# Altium schematic sheet EtherWiz.SchDoc
size A3; SheetNumber: 1; SheetTotal: 3
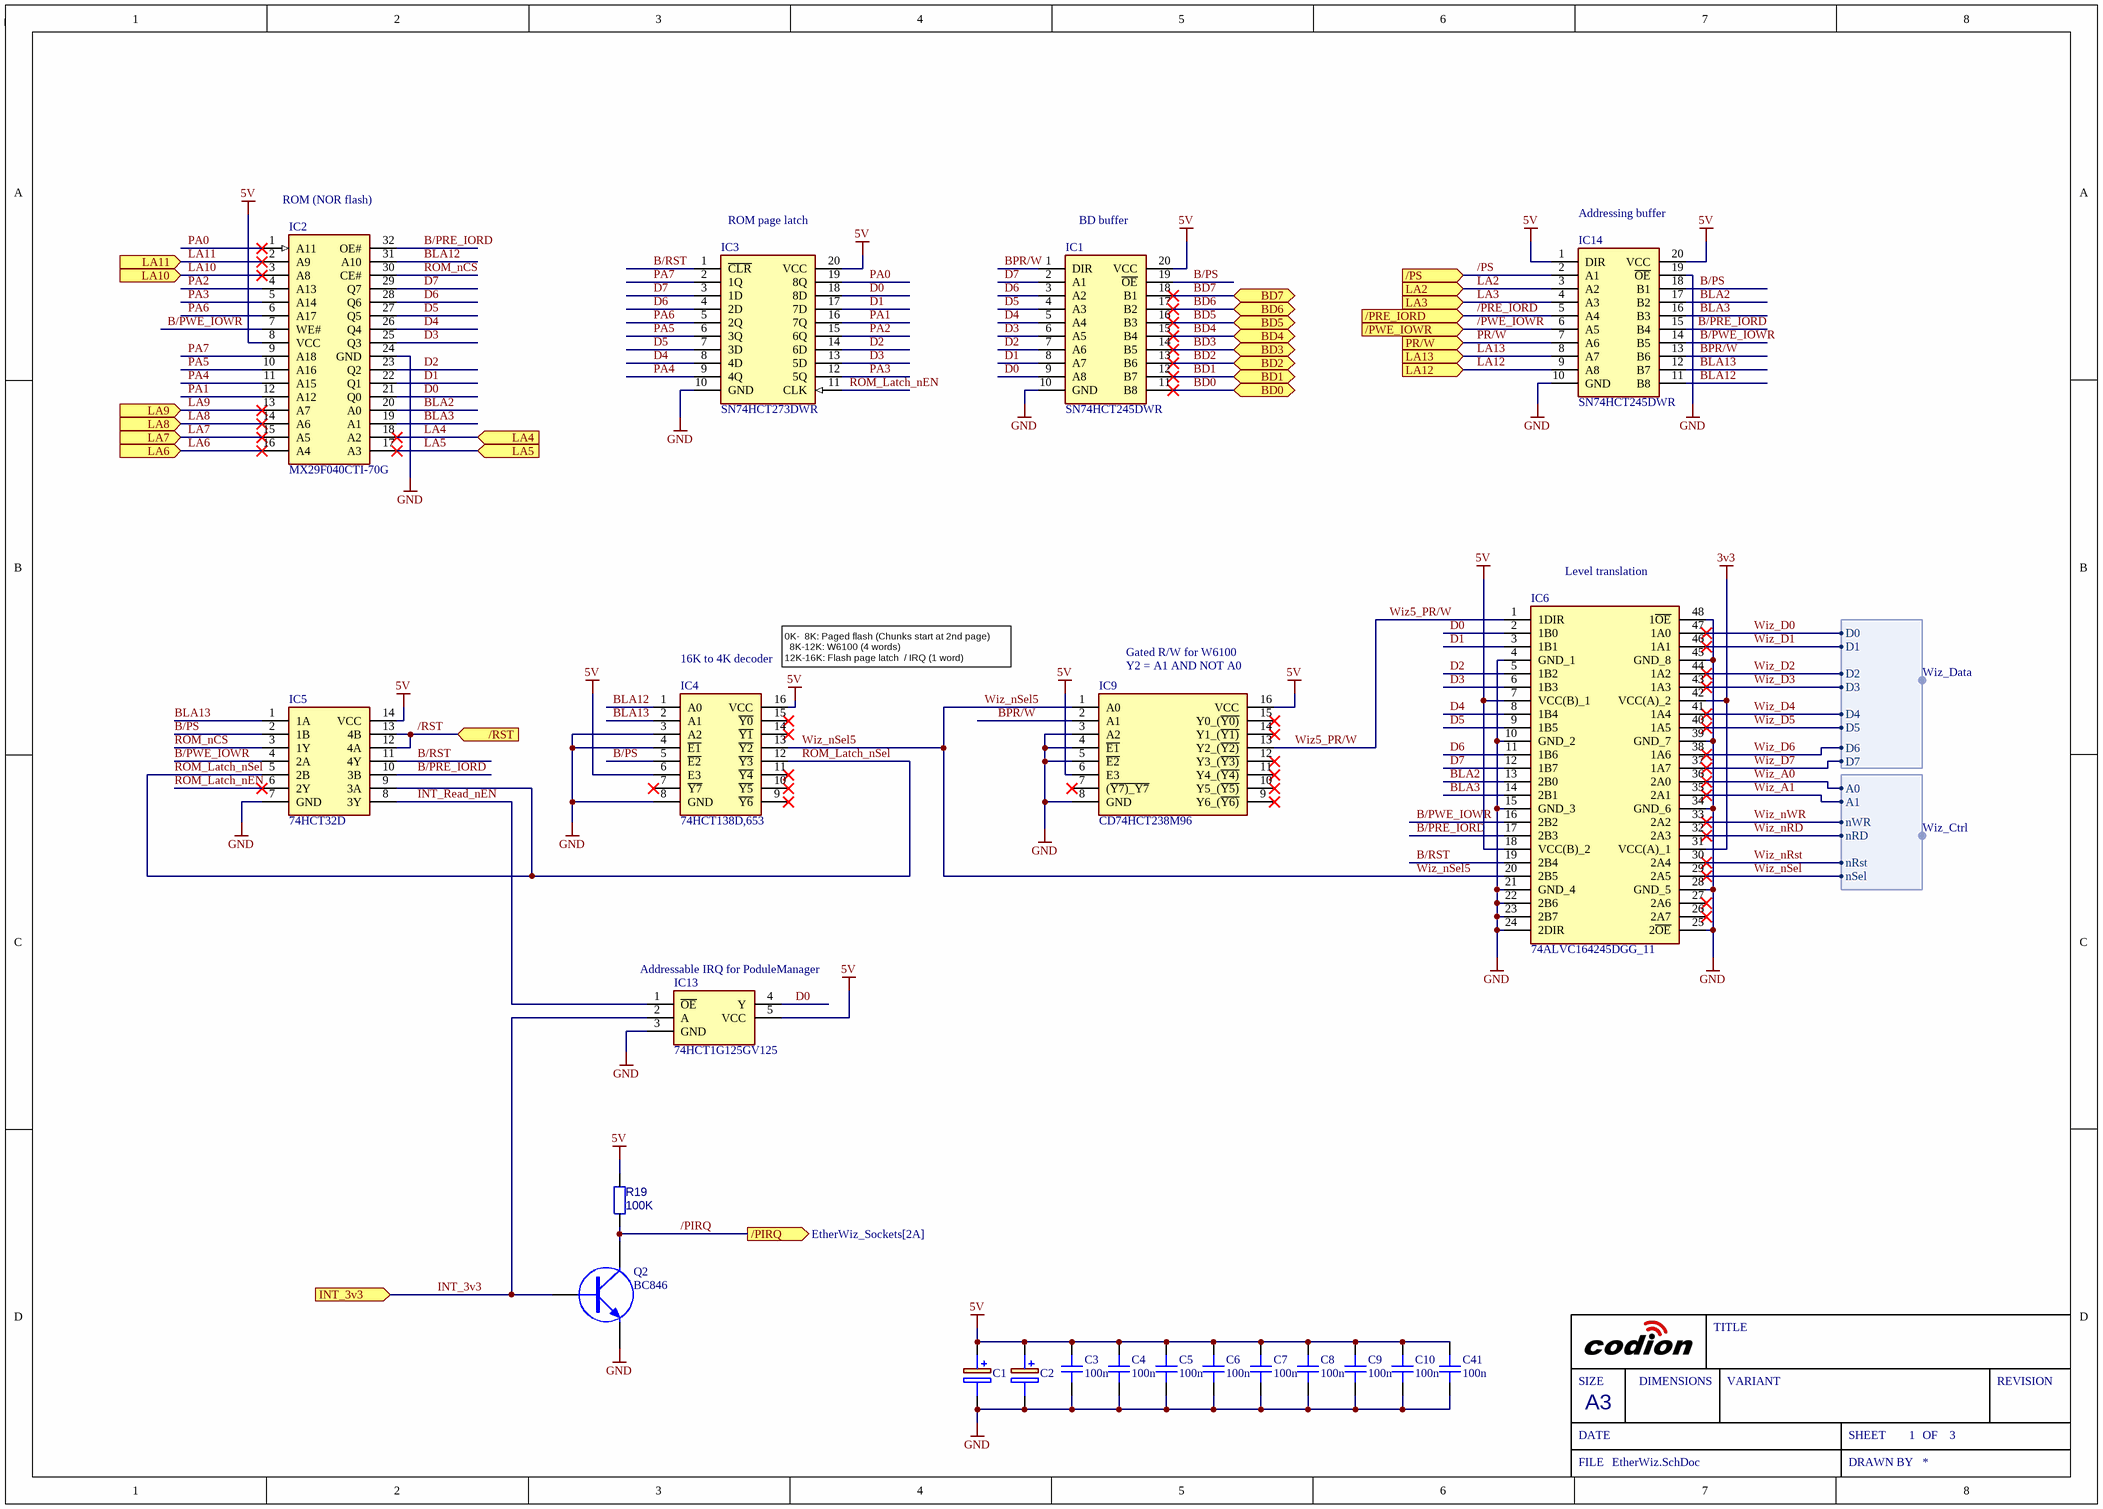
[diagram p0: EtherWiz.SchDoc]

## Parts
C1  EEE-HA1C470AP  [EEE1AA101SP]  (value not drawn)
C2  EEE-HA1C470AP  [EEE1AA101SP]  (value not drawn)
C3  100n  [CAPC1608L]
C4  100n  [CAPC1608L]
C5  100n  [CAPC1608L]
C6  100n  [CAPC1608L]
C7  100n  [CAPC1608L]
C8  100n  [CAPC1608L]
C9  100n  [CAPC1608L]
C10  100n  [CAPC1608L]
C41  100n  [CAPC1608L]
IC1  SN74HCT245DWR  [SOIC127P1030X265-20N]
IC2  MX29F040CTI-70G  [SOP50P2000X120-32N]
IC3  SN74HCT273DWR  [SOIC127P1030X265-20N]
IC4  74HCT138D,653  [SOIC127P600X175-16N]
IC5  74HCT32D  [SOIC127P600X175-14N]
IC6  74ALVC164245DGG_11  [SOP50P810X120-48N]
IC9  CD74HCT238M96  [SOIC127P600X175-16N]
IC13  74HCT1G125GV125  [SOT95P275X110-5N]
IC14  SN74HCT245DWR  [SOIC127P1030X265-20N]
Q2  BC846  [SOT-23]
R19  100K  [RESC1608X50N]

## Ports
/PIRQ (out, see EtherWiz_Sockets[2A]), /PRE_IORD (in, see EtherWiz_Sockets[2A]), /PS (in, see EtherWiz_Sockets[2B]), /PWE_IOWR (in, see EtherWiz_Sockets[2A]), /RST (in, see EtherWiz_Sockets[2A]), BD0 (bidir, see EtherWiz_Sockets[1B]), BD1 (bidir, see EtherWiz_Sockets[1B]), BD2 (bidir, see EtherWiz_Sockets[1B]), BD3 (bidir, see EtherWiz_Sockets[1B]), BD4 (bidir, see EtherWiz_Sockets[1B]), BD5 (bidir, see EtherWiz_Sockets[1B]), BD6 (bidir, see EtherWiz_Sockets[1B]), BD7 (bidir, see EtherWiz_Sockets[1B]), INT_3v3 (in, see EtherWiz_Controller[5A]), LA2 (in, see EtherWiz_Sockets[1A]), LA3 (in, see EtherWiz_Sockets[1A]), LA4 (in, see EtherWiz_Sockets[1A]), LA5 (in, see EtherWiz_Sockets[1A]), LA6 (in, see EtherWiz_Sockets[1A]), LA7 (in, see EtherWiz_Sockets[1A]), LA8 (in, see EtherWiz_Sockets[1A]), LA9 (in, see EtherWiz_Sockets[1A]), LA10 (in, see EtherWiz_Sockets[1A]), LA11 (in, see EtherWiz_Sockets[1A]), LA12 (in, see EtherWiz_Sockets[1A]), LA13 (in, see EtherWiz_Sockets[1A]), PR/W (in, see EtherWiz_Sockets[2A])

## Harnesses
Wiz_Data: D3, D7, D6, D0, D1, D5, D4, D2
Wiz_Ctrl: A0, A1, nWR, nRD, nRst, nSel

## Nets
3v3: IC6.31(VCC(A)_1) IC6.42(VCC(A)_2)
5V: C1.1(+) C2.1(+) C3.2 C4.2 C5.2 C6.2 C7.2 C8.2 C9.2 C10.2 C41.2 IC1.20(VCC) IC2.8(VCC) IC3.20(VCC) IC4.6(E3) IC4.16(VCC) IC5.14(VCC) IC6.7(VCC(B)_1) IC6.18(VCC(B)_2) IC9.6(E3) IC9.16(VCC) IC13.5(VCC) IC14.1(DIR) IC14.20(VCC) R19.2
GND: C1.2(-) C2.2(-) C3.1 C4.1 C5.1 C6.1 C7.1 C8.1 C9.1 C10.1 C41.1 IC1.10(GND) IC2.24(GND) IC3.10(GND) IC4.3(A2) IC4.4(~{E1}) IC4.8(GND) IC5.7(GND) IC6.4(GND_1) IC6.10(GND_2) IC6.15(GND_3) IC6.21(GND_4) IC6.22(2B6) IC6.23(2B7) IC6.24(2DIR) IC6.25(2~{OE}) IC6.28(GND_5) IC6.34(GND_6) IC6.39(GND_7) IC6.45(GND_8) IC6.48(1~{OE}) IC9.3(A2) IC9.4(~{E1}) IC9.5(~{E2}) IC9.8(GND) IC13.3(GND) IC14.10(GND) IC14.19(~{OE}) Q2.2(E)
/PIRQ: Q2.3(C) R19.1 ; port /PIRQ
/PRE_IORD: IC14.5(A4) ; port /PRE_IORD
/PS: IC14.2(A1) ; port /PS
/PWE_IOWR: IC14.6(A5) ; port /PWE_IOWR
/RST: IC5.12(4A) IC5.13(4B) ; port /RST
B/PRE_IORD: IC2.32(OE#) IC5.10(3B) IC6.17(2B3) IC14.15(B4)
B/PS: IC1.19(~{OE}) IC4.5(~{E2}) IC5.2(1B) IC14.18(B1)
B/PWE_IOWR: IC2.7(WE#) IC5.4(2A) IC6.16(2B2) IC14.14(B5)
B/RST: IC3.1(~{CLR}) IC5.11(4Y) IC6.19(2B4)
BD0: IC1.11(B8) ; port BD0
BD1: IC1.12(B7) ; port BD1
BD2: IC1.13(B6) ; port BD2
BD3: IC1.14(B5) ; port BD3
BD4: IC1.15(B4) ; port BD4
BD5: IC1.16(B3) ; port BD5
BD6: IC1.17(B2) ; port BD6
BD7: IC1.18(B1) ; port BD7
BLA2: IC2.20(A0) IC6.13(2B0) IC14.17(B2)
BLA3: IC2.19(A1) IC6.14(2B1) IC14.16(B3)
BLA12: IC2.31(A10) IC4.1(A0) IC14.11(B8)
BLA13: IC4.2(A1) IC5.1(1A) IC14.12(B7)
BPR/W: IC1.1(DIR) IC9.2(A1) IC14.13(B6)
D0: IC1.9(A8) IC2.21(Q0) IC3.18(8D) IC6.2(1B0) IC13.4(Y)
D1: IC1.8(A7) IC2.22(Q1) IC3.17(7D) IC6.3(1B1)
D2: IC1.7(A6) IC2.23(Q2) IC3.14(6D) IC6.5(1B2)
D3: IC1.6(A5) IC2.25(Q3) IC3.13(5D) IC6.6(1B3)
D4: IC1.5(A4) IC2.26(Q4) IC3.8(4D) IC6.8(1B4)
D5: IC1.4(A3) IC2.27(Q5) IC3.7(3D) IC6.9(1B5)
D6: IC1.3(A2) IC2.28(Q6) IC3.4(2D) IC6.11(1B6)
D7: IC1.2(A1) IC2.29(Q7) IC3.3(1D) IC6.12(1B7)
INT_3v3: IC13.2(A) Q2.1(B) ; port INT_3v3
INT_Read_nEN: IC5.8(3Y) IC13.1(~{OE})
LA2: IC14.3(A2) ; port LA2
LA3: IC14.4(A3) ; port LA3
LA4: IC2.18(A2) ; port LA4
LA5: IC2.17(A3) ; port LA5
LA6: IC2.16(A4) ; port LA6
LA7: IC2.15(A5) ; port LA7
LA8: IC2.14(A6) ; port LA8
LA9: IC2.13(A7) ; port LA9
LA10: IC2.3(A8) ; port LA10
LA11: IC2.2(A9) ; port LA11
LA12: IC14.9(A8) ; port LA12
LA13: IC14.8(A7) ; port LA13
PA0: IC2.1(A11) IC3.19(8Q)
PA1: IC2.12(A12) IC3.16(7Q)
PA2: IC2.4(A13) IC3.15(6Q)
PA3: IC2.5(A14) IC3.12(5Q)
PA4: IC2.11(A15) IC3.9(4Q)
PA5: IC2.10(A16) IC3.6(3Q)
PA6: IC2.6(A17) IC3.5(2Q)
PA7: IC2.9(A18) IC3.2(1Q)
PR/W: IC14.7(A6) ; port PR/W
ROM_Latch_nEN: IC3.11(CLK) IC5.6(2Y)
ROM_Latch_nSel: IC4.12(~{Y3}) IC5.5(2B) IC5.9(3A)
ROM_nCS: IC2.30(CE#) IC5.3(1Y)
Wiz5_PR/W: IC6.1(1DIR) IC9.13(Y2_(~{Y2)})
Wiz_A0: IC6.36(2A0) ; harness Wiz_Ctrl.A0
Wiz_A1: IC6.35(2A1) ; harness Wiz_Ctrl.A1
Wiz_D0: IC6.47(1A0) ; harness Wiz_Data.D0
Wiz_D1: IC6.46(1A1) ; harness Wiz_Data.D1
Wiz_D2: IC6.44(1A2) ; harness Wiz_Data.D2
Wiz_D3: IC6.43(1A3) ; harness Wiz_Data.D3
Wiz_D4: IC6.41(1A4) ; harness Wiz_Data.D4
Wiz_D5: IC6.40(1A5) ; harness Wiz_Data.D5
Wiz_D6: IC6.38(1A6) ; harness Wiz_Data.D6
Wiz_D7: IC6.37(1A7) ; harness Wiz_Data.D7
Wiz_nRD: IC6.32(2A3) ; harness Wiz_Ctrl.nRD
Wiz_nRst: IC6.30(2A4) ; harness Wiz_Ctrl.nRst
Wiz_nSel: IC6.29(2A5) ; harness Wiz_Ctrl.nSel
Wiz_nSel5: IC4.13(~{Y2}) IC6.20(2B5) IC9.1(A0)
Wiz_nWR: IC6.33(2A2) ; harness Wiz_Ctrl.nWR

Not connected (* = marked no-connect by the designer): IC4 7(~{Y7})* 9(~{Y6})* 10(~{Y5})* 11(~{Y4})* 14(~{Y1})* 15(~{Y0})*; IC6 26(2A7)* 27(2A6)*; IC9 7((~{Y7)_Y7})* 9(Y6_(~{Y6)})* 10(Y5_(~{Y5)})* 11(Y4_(~{Y4)})* 12(Y3_(~{Y3)})* 14(Y1_(~{Y1)})* 15(Y0_(~{Y0)})*

## Notes on the sheet
- (near IC2) ROM (NOR flash)
- (near IC3) ROM page latch
- (near IC1) BD buffer
- (near IC14) Addressing buffer
- (near IC6) Level translation
- (near IC4) 16K to 4K decoder
- (near IC4) 0K-  8K: Paged flash (Chunks start at 2nd page)
  8K-12K: W6100 (4 words)
  12K-16K: Flash page latch  / IRQ (1 word)
- (near IC9) Gated R/W for W6100
- (near IC9) Y2 = A1 AND NOT A0
- (near IC13) Addressable IRQ for PoduleManager
- SIZE
- DIMENSIONS
- TITLE
- VARIANT
- REVISION
- DATE
- A3
- SHEET
- OF
- FILE
- DRAWN BY

## Library data of the parts
C1 C2 = EEE-HA1C470AP: Capacitor Polarised; Manufacturer_Name: Panasonic; Datasheet Link: http://industrial.panasonic.com/cdbs/www-data/pdf/RDE0000/ABA0000C1148.pdf; Height: 7.8mm; Manufacturer_Part_Number: EEE-HA1C470AP; Mouser Part Number: 667-EEE-HA1C470AP; Mouser Price/Stock: https://www.mouser.co.uk/ProductDetail/Panasonic/EEE-HA1C470AP?qs=d1CqaRUMZD%2FL5qU1hDRerg%3D%3D; Arrow Part Number: EEE-HA1C470AP; Arrow Price/Stock: https://www.arrow.com/en/products/eeeha1c470ap/panasonic?utm_currency=USD&region=europe
C3-C10 C41 = CAP_100n_0603_50V_0: CAP 100nF, 0603, 50V, X7R, 10%; Manufacturer1: Samsung; ManuPart1: CL10B104KB8NNNC; ManuPart2: CC0603KRX7R9BB104; Value: 100n; Distributor1: Anglia; Manufacturer2: Yageo; Distributor2: Digikey; Distributor1 Part No: CL10B104KB8NNNC; Distributor2 Part No: 311-1344-2-ND; ComponentLinknURL: *; ComponentLink1Description: ComponentLinknURL1; ComponentLink1URL: https://media.digikey.com/pdf/Data%20Sheets/Samsung%20PDFs/CL_Series_MLCC_ds.pdf; ComponentLink2Description: ComponentLinknURL2; ComponentLink2URL: https://www.yageo.com/upload/media/product/productsearch/datasheet/mlcc/UPY-GPHC_X7R_6.3V-to-50V_18.pdf; Voltage: 50V
IC1 IC14 = SN74HCT245DWR: Integrated Circuit; Manufacturer_Name: Texas Instruments; Datasheet Link: https://datasheet.datasheetarchive.com/originals/distributors/SFDatasheet-6/sf-000131457.pdf; Height: 2.65mm; Manufacturer_Part_Number: SN74HCT245DWR; Mouser Part Number: 595-SN74HCT245DWR; Mouser Price/Stock: https://www.mouser.co.uk/ProductDetail/Texas-Instruments/SN74HCT245DWR?qs=st7IWvlL5%2FhHLMwvvkYTgw%3D%3D; Arrow Part Number: SN74HCT245DWR; Arrow Price/Stock: https://www.arrow.com/en/products/sn74hct245dwr/texas-instruments?region=nac
IC2 = MX29F040CTI-70G: Integrated Circuit; Manufacturer_Name: Macronix; Datasheet Link: https://www.macronix.com/Lists/Datasheet/Attachments/7266/MX29F040C,%205V,%204Mb,%20v2.2.pdf; Height: 1.2mm; Manufacturer_Part_Number: MX29F040CTI-70G; Arrow Part Number: MX29F040CTI-70G; Arrow Price/Stock: https://www.arrow.com/en/products/mx29f040cti-70g/macronix-international?region=nac
IC3 = SN74HCT273DWR: Integrated Circuit; Manufacturer_Name: Texas Instruments; Datasheet Link: https://datasheet.datasheetarchive.com/originals/distributors/Datasheets-36/DSA-718641.pdf; Height: 2.65mm; Manufacturer_Part_Number: SN74HCT273DWR; Mouser Part Number: 595-SN74HCT273DWR; Mouser Price/Stock: https://www.mouser.co.uk/ProductDetail/Texas-Instruments/SN74HCT273DWR?qs=SL3LIuy2dWww%2FZr6up0MdA%3D%3D; Arrow Part Number: SN74HCT273DWR; Arrow Price/Stock: https://www.arrow.com/en/products/sn74hct273dwr/texas-instruments
IC4 = 74HCT138D,653: Integrated Circuit; Manufacturer_Name: Nexperia; Datasheet Link: https://assets.nexperia.com/documents/data-sheet/74HC_HCT138.pdf; Height: 1.75mm; Manufacturer_Part_Number: 74HCT138D,653; Mouser Part Number: 771-74HCT138D-T; Mouser Price/Stock: https://www.mouser.co.uk/ProductDetail/Nexperia/74HCT138D653?qs=P62ublwmbi8MKahyK7iY6g%3D%3D; Arrow Part Number: 74HCT138D,653; Arrow Price/Stock: https://www.arrow.com/en/products/74hct138d653/nexperia?region=nac
IC5 = 74HCT32D: Integrated Circuit; Manufacturer_Name: Toshiba; Datasheet Link: https://toshiba.semicon-storage.com/info/docget.jsp?did=37176&prodName=74HCT32D; Height: 1.75mm; Manufacturer_Part_Number: 74HCT32D; Mouser Part Number: N/A; Mouser Price/Stock: https://www.mouser.co.uk/ProductDetail/Toshiba/74HCT32D?qs=j%252B1pi9TdxUZqVZos7uP1Yw%3D%3D; Arrow Part Number: 74HCT32D; Arrow Price/Stock: https://www.arrow.com/en/products/74hct32d/toshiba?region=nac
IC6 = 74ALVC164245DGG_11: Integrated Circuit; Manufacturer_Name: Nexperia; Manufacturer_Part_Number: 74ALVC164245DGG:11; Datasheet Link: https://assets.nexperia.com/documents/data-sheet/74ALVC164245.pdf; Height: 1.2mm; Mouser Part Number: 771-74ALVC164245; Mouser Price/Stock: https://www.mouser.co.uk/ProductDetail/Nexperia/74ALVC164245DGG11?qs=odJ8N4Y39o4j0ykFPcnqaQ%3D%3D; Arrow Part Number: 74ALVC164245DGG:11; Arrow Price/Stock: https://www.arrow.com/en/products/74alvc164245dgg11/nexperia?utm_currency=USD&region=nac
IC9 = CD74HCT238M96: Integrated Circuit; Manufacturer_Name: Texas Instruments; Datasheet Link: http://www.ti.com/lit/gpn/cd74hct238; Height: 1.75mm; Manufacturer_Part_Number: CD74HCT238M96; Mouser Part Number: 595-CD74HCT238M96; Mouser Price/Stock: https://www.mouser.co.uk/ProductDetail/Texas-Instruments/CD74HCT238M96?qs=xFfolx0DHx1u%2Fks4%2FbIqqQ%3D%3D
IC13 = 74HCT1G125GV125: Integrated Circuit; Manufacturer_Name: Nexperia; Datasheet Link: https://assets.nexperia.com/documents/data-sheet/74HC_HCT1G125.pdf; Height: 1.1mm; Manufacturer_Part_Number: 74HCT1G125GV125
Q2 = TRANS_NPN_BC846_0: Transistor NPN, 65V, 100mA, TO-236AB/SOT23; Value: BC846; ComponentLinknURL: *
R19 = 920-0030-L: Resistor 100K 1%  0603; Value: 100K